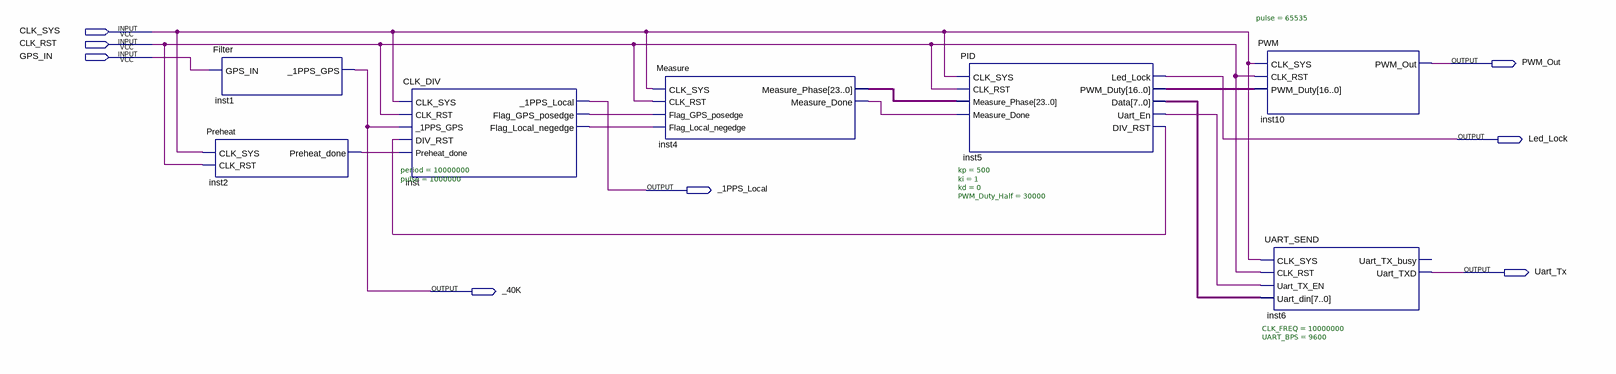
[diagram p0: schematic sheet]
// Quartus schematic GPSDO.bdf as structural Verilog: 7 symbols, 8 pins
module GPSDO (
  input  CLK_SYS,
  input  CLK_RST,
  input  GPS_IN,
  output PWM_Out,
  output Led_Lock,
  output _1PPS_Local,
  output Uart_Tx,
  output _40K
);

  wire inst2_preheat_done, inst4_measure_done, inst5_div_rst, inst5_uart_en, inst_flag_gps_posedge,
       inst_flag_local_negedge;
  wire [7:0] inst5_data;
  wire [16:0] inst5_pwm_duty;
  wire [23:0] inst4_measure_phase;

  Filter inst1 (.GPS_IN(GPS_IN), ._1PPS_GPS(_40K));
  Preheat inst2 (.CLK_SYS(CLK_SYS), .CLK_RST(CLK_RST), .Preheat_done(inst2_preheat_done));
  CLK_DIV #(.period(10000000), .pulse(1000000)) inst (
    .CLK_SYS(CLK_SYS), .CLK_RST(CLK_RST), ._1PPS_GPS(_40K), .DIV_RST(inst5_div_rst),
    .Preheat_done(inst2_preheat_done), ._1PPS_Local(_1PPS_Local), .Flag_GPS_posedge(inst_flag_gps_posedge),
    .Flag_Local_negedge(inst_flag_local_negedge));
  Measure inst4 (
    .CLK_SYS(CLK_SYS), .CLK_RST(CLK_RST), .Flag_GPS_posedge(inst_flag_gps_posedge),
    .Flag_Local_negedge(inst_flag_local_negedge), .Measure_Phase(inst4_measure_phase),
    .Measure_Done(inst4_measure_done));
  PID #(.kp(500), .ki(1), .kd(0), .PWM_Duty_Half(30000)) inst5 (
    .CLK_SYS(CLK_SYS), .CLK_RST(CLK_RST), .Measure_Phase(inst4_measure_phase),
    .Measure_Done(inst4_measure_done), .Led_Lock(Led_Lock), .PWM_Duty(inst5_pwm_duty), .Data(inst5_data),
    .Uart_En(inst5_uart_en), .DIV_RST(inst5_div_rst));
  PWM #(.pulse(65535)) inst10 (.CLK_SYS(CLK_SYS), .CLK_RST(CLK_RST), .PWM_Duty(inst5_pwm_duty), .PWM_Out(PWM_Out));
  UART_SEND #(.CLK_FREQ(10000000), .UART_BPS(9600)) inst6 (
    .CLK_SYS(CLK_SYS), .CLK_RST(CLK_RST), .Uart_TX_EN(inst5_uart_en), .Uart_din(inst5_data),
    .Uart_TXD(Uart_Tx));  // open: Uart_TX_busy
endmodule
